# Altium schematic sheet SDCard.SchDoc
size A4; PageSetup: Record=PageOptions|CenterHorizontal=True|CenterVertical=True|PrintScale=0.97|XCorrection=1.00|YCorrection=1.00|PrintKind=2|BorderSize=5000000|LeftOffset=0|BottomOffset=0|Orientation=2|PaperLength=1000|PaperWidth=1000|Scale=100|PaperSource=7|PrintQuality=-3|MediaType=1|DitherType=10|PrintScaleMode=1|PaperKind=A4|PaperIndex=9
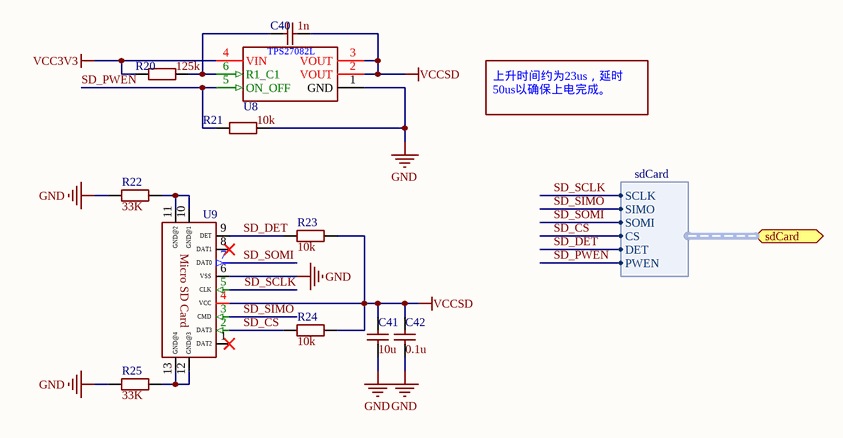
[diagram p0: SDCard.SchDoc]

## Parts
C40  value 1n  [C0402_h]  (hidden comment: Capacitor)
C41  value 10u  [C0402_h]  (hidden comment: Capacitor)
C42  value 0.1u  [C0402_h]  (hidden comment: Capacitor)
R20  value 125k  [R0402]  (hidden comment: Register)
R21  value 10k  [R0402]  (hidden comment: Register)
R22  value 33K  [R0402]  (hidden comment: Register)
R23  value 10k  [R0402]  (hidden comment: Register)
R24  value 10k  [R0402]  (hidden comment: Register)
R25  value 33K  [R0402]  (hidden comment: Register)
U8  TPS27082L  [SOT23-6]  (value not drawn)
U9  MicroSD  [MicroSD]  (value not drawn)

## Ports
sdCard (harness sdCard)

## Harnesses
sdCard: SCLK, SIMO, SOMI, CS, DET, PWEN

## Nets
GND: C41.1 C42.1 R21.1 R22.1 R25.1 U8.1(GND) U9.6(VSS)
VCC3V3: R20.1 U8.4(VIN)
VCCSD: C40.2 C41.2 C42.2 R23.2 R24.2 U8.2(VOUT) U8.3(VOUT) U9.4(VCC)
SD_CS: R24.1 U9.2(DAT3) ; port sdCard.CS
SD_DET: R23.1 U9.9(DET) ; port sdCard.DET
SD_PWEN: R21.2 U8.5(ON_OFF) ; port sdCard.PWEN
SD_SCLK: U9.5(CLK) ; port sdCard.SCLK
SD_SIMO: U9.3(CMD) ; port sdCard.SIMO
SD_SOMI: U9.7(DAT0) ; port sdCard.SOMI
NetC40_1: C40.1 R20.2 U8.6(R1_C1)
NetR22_2: R22.2 U9.10(GND@1) U9.11(GND@2)
NetR25_2: R25.2 U9.12(GND@3) U9.13(GND@4)

Not connected (* = marked no-connect by the designer): U9 1(DAT2)* 8(DAT1)*

## Notes on the sheet
- 上升时间约为23us，延时50us以确保上电完成。

## Library data of the parts
C40-C42 = 贴片电容-无极性: VDC: 10V; Published: 8-Jun-2000; LatestRevisionDate: 17-Jul-2002; LatestRevisionNote: Re-released for DXP Platform.; PackageReference: RAD-0.3; Publisher: Altium Limited; PackageDescription: Radial Cap, Thru-Hole; 2 Leads; 0.3 in Pin Spacing
R20-R25 = 贴片电阻
U8 = TPS27082LDDCR: load switch; Manufacturer: Texas Instruments; CompType: IC; PIN_COUNT: 6; PartNumber: TPS27082LDDC; PackageReference: DDC0006A; MountType: SMT; RoHS: Y; RefDes: RefDes; Type: DEV; Value: Value
U9 = Micro SD Card